# Altium schematic sheet DE-180824_2.SchDoc: DimmerBaseBoard
size A4; Author: eldar6776@hotmail.com; DrawnBy: Eldar Dedic; Organization: JUBERA d.o.o.; Address1: Braće Mulić 81; Address2: 71000 Sarajevo; Address3: Federacija BiH; Address4: Bosna i Hercegovina; DocumentNumber: DE-180824; Revision: 001; SheetNumber: 2; SheetTotal: 2; SPICEModelCacheBVBUIEPD: <root> / <DocumentId>BVBUIEPD</DocumentId> / </root>
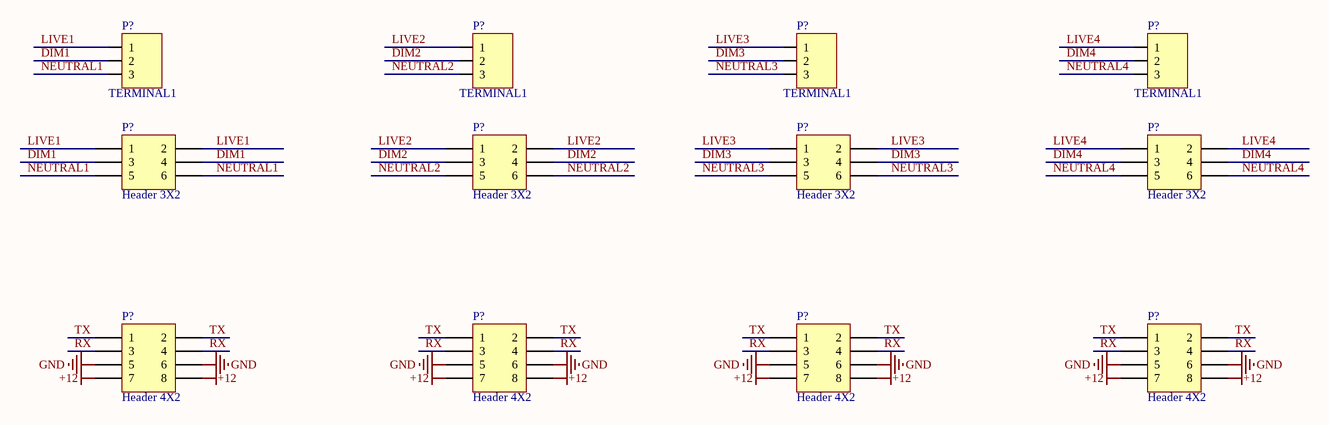
[diagram p0: DE-180824_2.SchDoc]

## Parts
(Parts that share a designator on the sheet are numbered #1, #2 ... from top to bottom, then left to right.)
P?#1  TERMINAL1  [3 PIN TERMINAL BLOCK  5mm]
P?#2  TERMINAL1  [3 PIN TERMINAL BLOCK  5mm]
P?#3  TERMINAL1  [3 PIN TERMINAL BLOCK  5mm]
P?#4  TERMINAL1  [3 PIN TERMINAL BLOCK  5mm]
P?#5  Header 3X2  [HDR2X3]
P?#6  Header 3X2  [HDR2X3]
P?#7  Header 3X2  [HDR2X3]
P?#8  Header 3X2  [HDR2X3]
P?#9  Header 4X2  [HDR2X4]
P?#10  Header 4X2  [HDR2X4]
P?#11  Header 4X2  [HDR2X4]
P?#12  Header 4X2  [HDR2X4]

## Nets
+12: P?#9.7 P?#9.8 P?#10.7 P?#10.8 P?#11.7 P?#11.8 P?#12.7 P?#12.8
GND: P?#9.5 P?#9.6 P?#10.5 P?#10.6 P?#11.5 P?#11.6 P?#12.5 P?#12.6
DIM1: P?#1.2 P?#5.3 P?#5.4
DIM2: P?#2.2 P?#6.3 P?#6.4
DIM3: P?#3.2 P?#7.3 P?#7.4
DIM4: P?#4.2 P?#8.3 P?#8.4
LIVE1: P?#1.1 P?#5.1 P?#5.2
LIVE2: P?#2.1 P?#6.1 P?#6.2
LIVE3: P?#3.1 P?#7.1 P?#7.2
LIVE4: P?#4.1 P?#8.1 P?#8.2
NEUTRAL1: P?#1.3 P?#5.5 P?#5.6
NEUTRAL2: P?#2.3 P?#6.5 P?#6.6
NEUTRAL3: P?#3.3 P?#7.5 P?#7.6
NEUTRAL4: P?#4.3 P?#8.5 P?#8.6
RX: P?#9.3 P?#9.4 P?#10.3 P?#10.4 P?#11.3 P?#11.4 P?#12.3 P?#12.4
TX: P?#9.1 P?#9.2 P?#10.1 P?#10.2 P?#11.1 P?#11.2 P?#12.1 P?#12.2

## Notes on the sheet
- Title
- Size:
- Date:
- A4
- Number:
- Time:
- Revision:
- Sheet
- of
- File:

## Library data of the parts
P?#1-P?#4 = TERMINAL BLOK 3: 3 pinski terminal blok konektor
P?#5-P?#8 = Header 3X2: Header, 3-Pin, Dual row; LatestRevisionDate: 17-Jul-2002; LatestRevisionNote: Re-released for DXP Platform.; Publisher: Altium Limited
P?#9-P?#12 = Header 4X2: Header, 4-Pin, Dual row; LatestRevisionDate: 17-Jul-2002; LatestRevisionNote: Re-released for DXP Platform.; Publisher: Altium Limited